# Altium project Rocos-FOC.PrjPcb
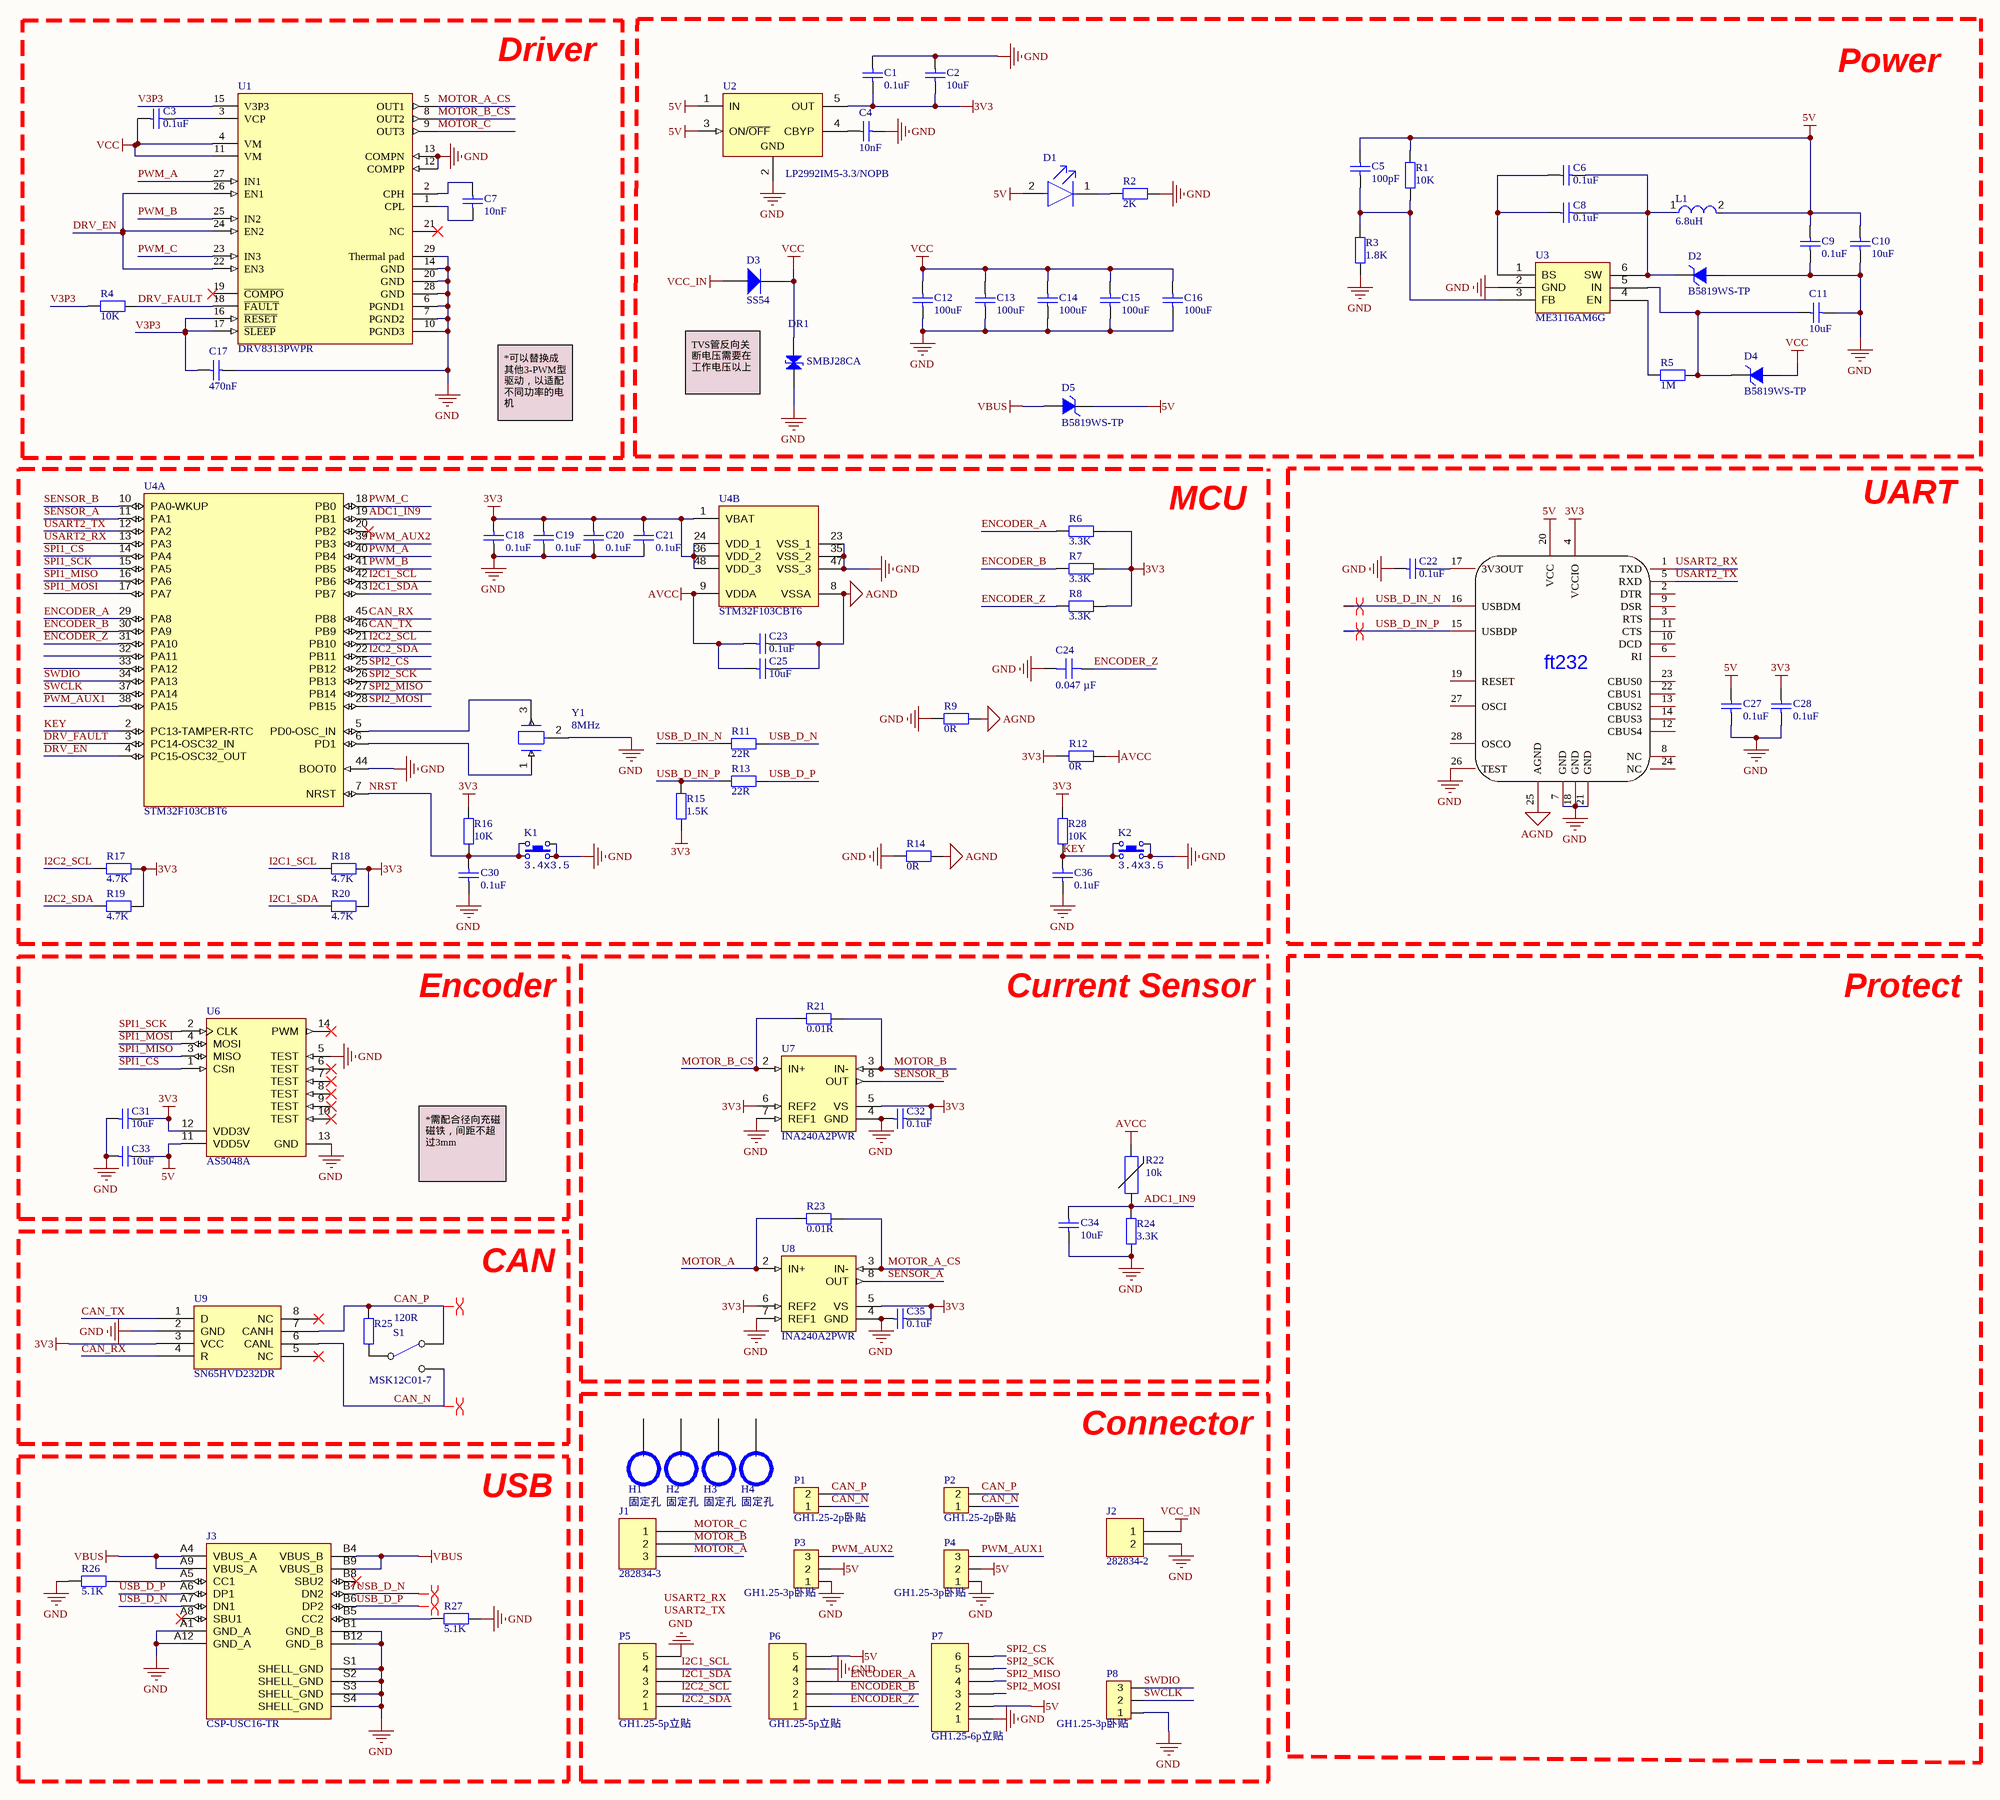
[diagram p0: Driver.SchDoc]
1 sheet, 96 parts. Net scope: global (net labels, ports and power ports of the same name join across sheets).
Board file: Driver.PcbDoc

## Sheet Driver.SchDoc
size 558 x 431 mm; SheetNumber: 1; SheetTotal: 1

### Parts
C1  0.1uF  [C 0402_L]
C2  10uF  [C 0402_L]
C3  0.1uF  [C 0402_L]
C4  10nF  [C 0402_L]
C5  100pF  [C 0402_L]
C6  0.1uF  [C 0402_L]
C7  10nF  [C 0402_L]
C8  0.1uF  [C 0402_L]
C9  0.1uF  [C 0402_L]
C10  10uF  [C 0402_L]
C11  10uF  [C 0402_L]
C12  100uF  [CAPC3216X190X55LL30T25]
C13  100uF  [CAPC3216X190X55LL30T25]
C14  100uF  [CAPC3216X190X55LL30T25]
C15  100uF  [CAPC3216X190X55LL30T25]
C16  100uF  [CAPC3216X190X55LL30T25]
C17  470nF  [C 0402_L]
C18  0.1uF  [C 0402_L]
C19  0.1uF  [C 0402_L]
C20  0.1uF  [C 0402_L]
C21  0.1uF  [C 0402_L]
C22  0.1uF  [C 0402_L]
C23  0.1uF  [C 0402_L]
C24  0.047 µF  [CAP 0402_1005]
C25  10uF  [C 0402_L]
C27  0.1uF  [C 0402_L]
C28  0.1uF  [C 0402_L]
C30  0.1uF  [C 0402_L]
C31  10uF  [C 0402_L]
C32  0.1uF  [C 0402_L]
C33  10uF  [C 0402_L]
C34  10uF  [C 0402_L]
C35  0.1uF  [C 0402_L]
C36  0.1uF  [C 0402_L]
D1  (no value)  [FP-APHHS1005CGCK-MFG]
D2  B5819WS-TP  [SOD-523]
D3  SS54  [SMA(DO-214AC)_S1]
D4  B5819WS-TP  [SOD-523]
D5  B5819WS-TP  [SOD-523]
DR1  SMBJ28CA  [SMB]
H1  固定孔  [铜柱孔3]
H2  固定孔  [铜柱孔3]
H3  固定孔  [铜柱孔3]
H4  固定孔  [铜柱孔3]
J1  282834-3  [TE 282834-3]
J2  282834-2  [TE 282834-2]
J3  CSP-USC16-TR  [VALCON_CSP-USC16-TR]
K1  value 3.4x3.5  [ButtonTACT_3.5*3.55_90]  (hidden comment: TACT 4P)
K2  value 3.4x3.5  [ButtonTACT_3.5*3.55_90]  (hidden comment: TACT 4P)
L1  6.8uH  [FP-LQH2MCN_52-MFG]
P1  GH1.25-2p卧贴  [GH1.25-2P]
P2  GH1.25-2p卧贴  [GH1.25-2P]
P3  GH1.25-3p卧贴  [GH1.25-3P]
P4  GH1.25-3p卧贴  [GH1.25-3P]
P5  GH1.25-5p立贴  [GH1.25-5p]
P6  GH1.25-5p立贴  [GH1.25-5p]
P7  GH1.25-6p立贴  [GH1.25-6p]
P8  GH1.25-3p卧贴  [GH1.25-3P]
R1  10K  [R 0402_L]
R2  2K  [R 0402_L]
R3  1.8K  [R 0402_L]
R4  10K  [R 0402_L]
R5  1M  [R 0402_L]
R6  3.3K  [R 0402_L]
R7  3.3K  [R 0402_L]
R8  3.3K  [R 0402_L]
R9  0R  [R 0402_L]
R11  22R  [R 0402_L]
R12  0R  [R 0402_L]
R13  22R  [R 0402_L]
R14  0R  [R 0402_L]
R15  1.5K  [R 0402_L]
R16  10K  [R 0402_L]
R17  4.7K  [R 0402_L]
R18  4.7K  [R 0402_L]
R19  4.7K  [R 0402_L]
R20  4.7K  [R 0402_L]
R21  0.01R  [R 0402_L]
R22  value 10k  [RES_0402]  (hidden comment: NCP15XH103F03RC)
R23  0.01R  [R 0402_L]
R24  3.3K  [R 0402_L]
R25  120R  [R 0402_L]
R26  5.1K  [R 0402_L]
R27  5.1K  [R 0402_L]
R28  10K  [R 0402_L]
S1  MSK12C01-7  [MSK-12C01-07]
U1  DRV8313PWPR  [FP-PWP0028C-IPC_B]
U2  LP2992IM5-3.3/NOPB  [DBV0005A_L]
U3  ME3116AM6G  [SOT-23-6]
U4  STM32F103CBT6  [LQFP-48_7x7x05P]  (parts A,B of 2)
U5  FT232RL-REEL  [SSOP28]  (value not drawn)
U6  AS5048A  [TSSOP-14]
U7  INA240A2PWR  [SOP65 P640X120-8N]
U8  INA240A2PWR  [SOP65 P640X120-8N]
U9  Manufacturer Part Number: SN65HVD232DR  [SO-8]  (hidden comment: SN65HVD232D)
Y1  8MHz  [FP-CSTNE8M00GH5C000R0-MFG]

### Blocks framed on the sheet
Driver: C3 C7 C17 R4 U1
Power: C1 C2 C4-C6 C8-C16 D1-D5 DR1 L1 R1-R3 R5 U2 U3
MCU: C18-C21 C23-C25 C30 C36 K1 K2 R6-R9 R11-R20 R28 U4 Y1
UART: C22 C27 C28 U5
Encoder: C31 C33 U6
Current Sensor: C32 C34 C35 R21-R24 U7 U8
CAN: R25 S1 U9
Connector: H1-H4 J1 J2 P1-P8
USB: J3 R26 R27

### Nets
3V3: C1.1 C2.1 C18.1 C19.1 C20.1 C21.1 C28.1 C31.1 C32.1 C35.1 R6.2 R7.2 R8.2 R12.1 R15.1 R16.2 R17.2 R18.2 R19.2 R20.2 R28.2 U2.5(OUT) U4.1(VBAT) U4.24(VDD_1) U4.36(VDD_2) U4.48(VDD_3) U5.4(VCCIO) U6.12(VDD3V) U7.5(VS) U7.6(REF2) U8.5(VS) U8.6(REF2) U9.3(VCC)
5V: C5.2 C9.1 C10.2 C27.1 C33.1 D1.2(A) D5.2(K) L1.2 P3.2 P4.2 P6.5 P7.2 R1.2 U2.1(IN) U2.3(ON/~{OFF}) U5.20(VCC) U6.11(VDD5V)
AGND: C23.1 C25.1 R9.2 R14.2 U4.8(VSSA) U5.25(AGND)
AVCC: C23.2 C25.2 R12.2 R22.2 U4.9(VDDA)
GND: C1.2 C2.2 C4.1 C9.2 C10.1 C11.1 C12.1 C13.1 C14.1 C15.1 C16.1 C17.2 C18.2 C19.2 C20.2 C21.2 C22.2 C24.1 C27.2 C28.2 C30.2 C31.2 C32.2 C33.2 C34.2 C35.2 C36.2 D2.1(A) DR1.2(K) J2.2 J3.A1(GND_A) J3.A12(GND_A) J3.B1(GND_B) J3.B12(GND_B) J3.S1(SHELL_GND) J3.S2(SHELL_GND) J3.S3(SHELL_GND) J3.S4(SHELL_GND) K1.2 K1.4 K2.2 K2.4 P3.1 P4.1 P5.5 P6.4 P7.1 P8.1 R2.2 R3.1 R9.1 R14.1 R24.1 R26.2 R27.1 U1.6(PGND1) U1.7(PGND2) U1.10(PGND3) U1.12(COMPP) U1.13(COMPN) U1.14(GND) U1.20(GND) U1.28(GND) U1.29(Thermal_pad) U2.2(GND) U3.2(GND) U4.23(VSS_1) U4.35(VSS_2) U4.44(BOOT0) U4.47(VSS_3) U5.7(GND) U5.18(GND) U5.21(GND) U5.26(TEST) U6.5(TEST) U6.13(GND) U7.4(GND) U7.7(REF1) U8.4(GND) U8.7(REF1) U9.2(GND) Y1.2(GND)
VBUS: D5.1(A) J3.A4(VBUS_A) J3.A9(VBUS_A) J3.B4(VBUS_B) J3.B9(VBUS_B)
VCC: C3.2 C12.2 C13.2 C14.2 C15.2 C16.2 D3.2(K) D4.1(A) DR1.1(A) U1.4(VM) U1.11(VM)
VCC_IN: D3.1(A) J2.1
ADC1_IN9: C34.1 R22.1 R24.2 U4.19(PB1)
CAN_N: P1.1 P2.1 S1.3 U9.6(CANL)
CAN_P: P1.2 P2.2 R25.2 S1.1 U9.7(CANH)
CAN_RX: U4.45(PB8) U9.4(R)
CAN_TX: U4.46(PB9) U9.1(D)
DRV_EN: U1.22(EN3) U1.24(EN2) U1.26(EN1) U4.4(PC15-OSC32_OUT)
DRV_FAULT: R4.1 U1.18(~{FAULT}) U4.3(PC14-OSC32_IN)
ENCODER_A: P6.3 R6.1 U4.29(PA8)
ENCODER_B: P6.2 R7.1 U4.30(PA9)
ENCODER_Z: C24.2 P6.1 R8.1 U4.31(PA10)
I2C1_SCL: P5.4 R18.1 U4.42(PB6)
I2C1_SDA: P5.3 R20.1 U4.43(PB7)
I2C2_SCL: P5.2 R17.1 U4.21(PB10)
I2C2_SDA: P5.1 R19.1 U4.22(PB11)
KEY: C36.1 K2.1 K2.3 R28.1 U4.2(PC13-TAMPER-RTC)
MOTOR_A: J1.3 R23.2 U8.2(IN+)
MOTOR_A_CS: R23.1 U1.5(OUT1) U8.3(IN-)
MOTOR_B: J1.2 R21.1 U7.3(IN-)
MOTOR_B_CS: R21.2 U1.8(OUT2) U7.2(IN+)
MOTOR_C: J1.1 U1.9(OUT3)
NRST: C30.1 K1.1 K1.3 R16.1 U4.7(NRST)
PWM_A: U1.27(IN1) U4.40(PB4)
PWM_AUX1: P4.3 U4.38(PA15)
PWM_AUX2: P3.3 U4.39(PB3)
PWM_B: U1.25(IN2) U4.41(PB5)
PWM_C: U1.23(IN3) U4.18(PB0)
SENSOR_A: U4.11(PA1) U8.8(OUT)
SENSOR_B: U4.10(PA0-WKUP) U7.8(OUT)
SPI1_CS: U4.14(PA4) U6.1(CSn)
SPI1_MISO: U4.16(PA6) U6.3(MISO)
SPI1_MOSI: U4.17(PA7) U6.4(MOSI)
SPI1_SCK: U4.15(PA5) U6.2(CLK)
SPI2_CS: P7.6 U4.25(PB12)
SPI2_MISO: P7.4 U4.27(PB14)
SPI2_MOSI: P7.3 U4.28(PB15)
SPI2_SCK: P7.5 U4.26(PB13)
SWCLK: P8.2 U4.37(PA14)
SWDIO: P8.3 U4.34(PA13)
USART2_RX: U4.13(PA3) U5.1(TXD)
USART2_TX: U4.12(PA2) U5.5(RXD)
USB_D_IN_N: R11.1 U5.16(USBDM)
USB_D_IN_P: R13.1 R15.2 U5.15(USBDP)
USB_D_N: J3.A7(DN1) J3.B7(DN2) R11.2
USB_D_P: J3.A6(DP1) J3.B6(DP2) R13.2
V3P3: C17.1 R4.2 U1.15(V3P3) U1.16(~{RESET}) U1.17(~{SLEEP})
NetC3_1: C3.1 U1.3(VCP)
NetC4_2: C4.2 U2.4(CBYP)
NetC5_1: C5.1 R1.1 R3.2 U3.3(FB)
NetC6_1: C6.1 C8.1 D2.2(K) L1.1 U3.6(SW)
NetC6_2: C6.2 C8.2 U3.1(BS)
NetC7_1: C7.1 U1.1(CPL)
NetC7_2: C7.2 U1.2(CPH)
NetC11_2: C11.2 D4.2(K) R5.1 U3.5(IN)
NetC22_1: C22.1 U5.17(3V3OUT)
NetD1_1: D1.1(C) R2.1
NetJ3_A5: J3.A5(CC1) R26.1
NetJ3_B5: J3.B5(CC2) R27.2
NetR5_2: R5.2 U3.4(EN)
NetR25_1: R25.1 S1.2
NetU4_5: U4.5(PD0-OSC_IN) Y1.3(Output)
NetU4_6: U4.6(PD1) Y1.1(Input)

Not connected (* = marked no-connect by the designer): H1 11; H2 11; H3 11; H4 11; J3 A8(SBU1)* B8(SBU2)*; U1 19(~{COMPO})* 21(NC)*; U4 20(PB2)* 32(PA11) 33(PA12); U5 2(DTR) 3(RTS) 6(RI) 8(NC) 9(DSR) 10(DCD) 11(CTS) 12(CBUS4) 13(CBUS2) 14(CBUS3) 19(RESET) 22(CBUS1) 23(CBUS0) 24(NC) 27(OSCI) 28(OSCO); U6 6(TEST)* 7(TEST)* 8(TEST)* 9(TEST)* 10(TEST)* 14(PWM)*; U9 5(NC)* 8(NC)*

### Layout directives
differential pair: CAN_N, CAN_P, USB_D_IN_N, USB_D_IN_P, USB_D_N, USB_D_P

### Notes on the sheet
- TVS管反向关断电压需要在工作电压以上
- *可以替换成其他3-PWM型驱动，以适配不同功率的电机
- (near U5) ft232
- Protect
- *需配合径向充磁磁铁，间距不超过3mm
- Labels drawn without touching a wire or pin: USART2_RX, USART2_TX
- DWG. NO.
- REV.
- SHT.
- REVISION
- DESCRIPTION
- DATE
- APPROVED
- THIS DOCUMENT AND THE DATA DISCLOSED HEREIN OR HEREWITH IS THE PROPERTY OF ALTIUM LIMITED AND MAY BE FREELY DISTRIBUTED IN WHOLE. NO RIGHTS ARE RESERVED OR EXPRESS OR IMPLIED WARANTEE GIVEN.
- ENG:
- DSN:
- APPROVALS
- PROJECT
- DOCUMENT REVISION:
- DESIGN ITEM:
- CHK:
- BOM:
- REFERENCE DOCUMENTS
- PROJECT REVISION:
- TITLE
- FAB DWG:
- PCB DWG:
- ASSY DWG:
- SCALE:
- SIZE
- C
- CAGE CODE
- FILE NAME
- DWG NO.
- SHEET
- OF
- REV

### Library data of the parts
C1-C4 C6 C8-C11 C18-C23 C25 C27 C28 C30-C36 = 0402 100nF (104) 10% 16V: 贴片电容; ComponentLink1Description: 供应商链接; ComponentLink1URL: http://www.szlcsc.com/product/details_1877.html; Package: 0402; Supplier: LC; SuppliersPartNumber: C1525
C5 = 0402 100pF (101) 5% 50V: 贴片电容; ComponentLink1Description: 供应商链接; ComponentLink1URL: http://www.szlcsc.com/product/details_1898.html; Package: 0402; Supplier: LC; SuppliersPartNumber: C1546
C7 = 0402 10nF (103) 10% 50V: 贴片电容; ComponentLink1Description: 供应商链接; ComponentLink1URL: http://www.szlcsc.com/product/details_15869.html; Package: 0402; Supplier: LC; SuppliersPartNumber: C15195
C12-C16 = CMP-1662-00011-2: Chip Capacitor, 100 uF, +/- 20%, 6.3 V, -55 to 85 degC, 1206 (3216 Metric), RoHS, Tape and Reel; PartNumber: GRM31CR60J107ME39L; Case\/Package: 1206; Voltage Rating (DC): 6.3 V; Type (Capacitors): X5R; REACH SVHC: No SVHC; Height: 1.6 mm; Tolerance: 20%; Packaging: Tape and Reel; Mount: Surface Mount; PackageDescription: 2-Pin Surface Mount Device, Body 3.2 x 1.6 mm; ComponentLink1URL: http://www.murata.com/; Pins: 2; ComponentLink2Description: Datasheet; PackageReference: 1206; Width: 1.6 mm; Package Quantity: 2000; Capacitance: 100 uF; Min Operating Temperature: -55 degC; Case Code (Imperial): 1206; Max Operating Temperature: 85 degC; DatasheetVersion: 09/2016; Mounting Technology: Surface Mount; Voltage Rating: 6.3 V; ComponentLink1Description: Manufacturer URL; Radiation Hardening: No; Case Code (Metric): 3216; Length: 3.2 mm; ComponentLink2URL: http://psearch.en.murata.com/capacitor/product/GRM31CR60J107ME39%23.pdf; RoHSCompliant: true
C17 = 0402 470nF (474) 10% 10V: 贴片电容; ComponentLink1Description: 供应商链接; ComponentLink1URL: http://www.szlcsc.com/product/details_48344.html; Package: 0402; Supplier: LC; SuppliersPartNumber: C47339
C24 = C0402C473K3REC7867: CAP CER 0402 47NF 25V X7R 10%; manufacturer: KEMET; Part Number: C0402C473K3REC7867; Value: 0.047 µF; Applications: ESD Protection; Capacitance: 0.047 µF; componentlink1description: Datasheet; componentlink1url: https://api.kemet.com/component-edge/download/datasheet/C0402C473K3REC7867.pdf; componentlink2description: DigiKey Link; componentlink2url: https://www.digikey.com/en/products/detail/kemet/C0402C473K3REC7867/8643594; Device Package: 0402 (1005 Metric); lastupdated: 2022/8/26 11:23:32; Lifecycle Status: Active; Minimum Order: 1; Mounting Type: Surface Mount, MLCC; Operating Temperature: -55°C ~ 125°C; Package / Case: 0402 (1005 Metric); packaging: TapeAndReel; partid: 33555; Part Status: Active; price: 0.01; series: ESD SMD Comm X7R; Size / Dimension: 0.039" L x 0.020" W (1.00mm x 0.50mm); Supplier 1: DigiKey; Supplier Part Number 1: 399-C0402C473K3REC7867CT-ND; Temperature Coefficient: X7R; Thickness (Max): 0.022" (0.55mm); Tolerance: ±10%; Voltage - Rated: 25V
D1 = CMP-44529-000044-1: LED GREEN CLEAR CHIP SMD; Viewing Angle: 120°; Dominant Wavelength: 570nm; Test Current: 20mA; Luminous Intensity: 50mcd; Forward Voltage: 2.1V; Number of LEDs: 1; Lens Color: Clear; Packaging: Tape and Reel; Max Operating Temperature: 85°C; Illumination Color: Green; Length: 1mm; Mount: Surface Mount; Lens Style: Clear; Color: Green; Number of Pins: 2; Wavelength: 570nm; Case/Package: 0402; Width: 0.5mm; Package Quantity: 2000; Case Code (Metric): 1005; Height: 0.6mm; Lead Free: Lead Free; Case Code (Imperial): 0402; Forward Current: 20mA; Min Operating Temperature: -40°C
D2 D4 D5 = 1N4733: 5.1V/1W稳压管; 版权归属: 源创客; BOM名称: 5.1V/1W稳压管; 学习资源: www.ooocke.com
D3 = SMA(DO-214AC) SS54: 二极管; ComponentLink1Description: 供应商链接; ComponentLink1URL: http://www.szlcsc.com/product/details_23178.html; Package: SMA(DO-214AC); Supplier: LC; SuppliersPartNumber: C22452
DR1 = DR: 瞬态电压抑制二极管; 版权归属: 源创客; BOM名称: 瞬态电压抑制二极管; 学习资源: www.ooocke.com
J1 = 282834-3: TERM BLK 3P SIDE ENT 2.54MM PCB; Manufacturer: TE Connectivity AMP Connectors; Current: 10A; Mating Orientation: Horizontal with Board; Number of Levels: 1; Pitch: 0.100" (2.54mm); Positions Per Level: 3; Voltage: 150V; Wire Gauge: 16-30 AWG; Wire Termination: Screw - Rising Cage Clamp; Part Number: 282834-3; Color: Green; ComponentLink1Description: Datasheet; ComponentLink1URL: https://www.te.com/commerce/DocumentDelivery/DDEController?Action=srchrtrv&DocNm=282834&DocType=Customer+Drawing&DocLang=English; ComponentLink2Description: DigiKey Link; ComponentLink2URL: http://digikey.com/product-detail/en/te-connectivity-amp-connectors/282834-3/A98334-ND/1153264; LastUpdated: 2020/1/15 4:15:50; Lifecycle Status: Active; Minimum Order: 1; Mounting Type: Through Hole; Packaging: Bulk; Part Status: Active; Price: 2.01; Series: Buchanan; Supplier 1: DigiKey; Supplier Part Number 1: A98334-ND
J2 = 282834-2: TERM BLK 2P SIDE ENT 2.54MM PCB; Manufacturer: TE Connectivity AMP Connectors; Current: 10A; Mating Orientation: Horizontal with Board; Number of Levels: 1; Pitch: 0.100" (2.54mm); Positions Per Level: 2; Voltage: 150V; Wire Gauge: 16-30 AWG; Wire Termination: Screw - Rising Cage Clamp; Part Number: 282834-2; Color: Green; ComponentLink1Description: Datasheet; ComponentLink1URL: https://www.te.com/commerce/DocumentDelivery/DDEController?Action=srchrtrv&DocNm=282834&DocType=Customer+Drawing&DocLang=English; ComponentLink2Description: DigiKey Link; ComponentLink2URL: http://digikey.com/product-detail/en/te-connectivity-amp-connectors/282834-2/A98333-ND/1150135; LastUpdated: 2020/1/15 4:15:38; Lifecycle Status: Active; Minimum Order: 1; Mounting Type: Through Hole; Packaging: Bulk; Part Status: Active; Price: 0.88; Series: Buchanan; Supplier 1: DigiKey; Supplier Part Number 1: A98333-ND
J3 = CSP-USC16-TR: CSP-USC16-TR Valcon USB Type C Surface Mount PCB Socket; Package: None; Purchase-URL: https://pricing.snapeda.com/search/part/CSP-USC16-TR/?ref=eda; MP: CSP-USC16-TR; Check_prices: https://www.snapeda.com/parts/CSP-USC16-TR/Valcon/view-part/4783629/?ref=eda; MF: Valcon; Value: *; Availability: No availability data; Price: None; SnapEDA_Link: https://www.snapeda.com/parts/CSP-USC16-TR/Valcon/view-part/4783629/?ref=snap
K1 K2 = ButtonTACT: Button; type: TACT 4P
L1 = CMP-06042-015166-1: Wire Wound Ferrite Inductor for Power Lines 6.8μH ±20% 1.6Ω 285mA 0806; Shielding: Unshielded; Test Frequency: 1MHz; Self Resonant Frequency: 65MHz; DC Resistance (DCR): 1.6R; Military Standard: Not; Length: 2mm; Case Code (Metric): 2016; Current Rating: 285mA; Package Quantity: 3000; Weight: 0.000317oz; Case Code (Imperial): 0806; Max Operating Temperature: 85°C; Width: 0.063inch; DC Current: 285mA; Core Material: Ferrite; Resistor Type: Wirewound; Inductance: 6.8uH; Height - Seated (Max): 0.037inch; Max DC Current: 285mA; Depth: 1.8mm; Termination: SMD/SMT; Min Operating Temperature: -40°C; Case/Package: 0806; Mount: Surface Mount; Tolerance: 20%; Packaging: Tape and Reel; Height: 0.9mm; Radiation Hardening: No
P1 P2 = SH1.0-2P
P3 P4 P8 = HDR1x3_2.54: Header
P5 P6 = MHDR1X5: Header, 5-Pin; LatestRevisionDate: 17-Jul-2002; LatestRevisionNote: Re-released for DXP Platform.; Publisher: Altium Limited
P7 = MHDR1X6: Header, 6-Pin; LatestRevisionDate: 17-Jul-2002; LatestRevisionNote: Re-released for DXP Platform.; Publisher: Altium Limited
R1 R3 R4 R26 R27 = 0402 1.2KΩ (1201) 1%: 贴片电阻; ComponentLink1Description: 供应商链接; ComponentLink1URL: http://www.szlcsc.com/product/details_26605.html; Package: 0402; Supplier: LC; SuppliersPartNumber: C25862
R2 R5 = 0402 2KΩ (2001) 1%: 贴片电阻; ComponentLink1Description: 供应商链接; ComponentLink1URL: http://www.szlcsc.com/product/details_4516.html; Package: 0402; Supplier: LC; SuppliersPartNumber: C4109
R6-R8 R24 = 0402 3.3KΩ (3301) 1%: 贴片电阻; ComponentLink1Description: 供应商链接; ComponentLink1URL: http://www.szlcsc.com/product/details_26633.html; Package: 0402; Supplier: LC; SuppliersPartNumber: C25890
R9 R12 R14 = 0402 0Ω (0R0) 1%: 贴片电阻; ComponentLink1Description: 供应商链接; ComponentLink1URL: http://www.szlcsc.com/product/details_17853.html; Package: 0402; Supplier: LC; SuppliersPartNumber: C17168
R11 R13 R21 R23 = 0402 22Ω (22R0) 1%: 贴片电阻; ComponentLink1Description: 供应商链接; ComponentLink1URL: http://www.szlcsc.com/product/details_25835.html; Package: 0402; Supplier: LC; SuppliersPartNumber: C25092
R15 = 0402 1.5KΩ (1501) 1%: 贴片电阻; ComponentLink1Description: 供应商链接; ComponentLink1URL: http://www.szlcsc.com/product/details_26610.html; Package: 0402; Supplier: LC; SuppliersPartNumber: C25867
R16 R28 = 0402 10KΩ (1002) 1%: 贴片电阻; ComponentLink1Description: 供应商链接; ComponentLink1URL: http://www.szlcsc.com/product/details_26487.html; Package: 0402; Supplier: LC; SuppliersPartNumber: C25744
R17-R20 = 0402 4.7KΩ (4701) 1%: 贴片电阻; ComponentLink1Description: 供应商链接; ComponentLink1URL: http://www.szlcsc.com/product/details_26643.html; Package: 0402; Supplier: LC; SuppliersPartNumber: C25900
R22 = NCP15XH103F03RC: THERMISTOR 10K OHM NTC 0402 SMD
R25 = 0402 120Ω (1200) 1%: 贴片电阻; ComponentLink1Description: 供应商链接; ComponentLink1URL: http://www.szlcsc.com/product/details_25822.html; Package: 0402; Supplier: LC; SuppliersPartNumber: C25079
S1 = T8013三脚两档钮子开关
U1 = CMP-04915-000025-1: IC MOTOR DRIVER 8V-60V 28HTSSOP; Min Supply Voltage: 8V; Max Supply Voltage: 60V; Interface: Parallel; Output Current: 1.75A; Number of Outputs: 1; Logic Function: AND GATE; Package Quantity: 2000; Number of Pins: 28; Case/Package: HTSSOP; Min Operating Temperature: -40°C; Mount: Surface Mount; Series: -; Packaging: Tape and Reel; Max Operating Temperature: 125°C; Lead Free: Lead Free
U2 = CMP-0062-02175-3: Micropower 250 mA Low-Noise Ultra Low-Dropout Regulator, 5-pin SOT-23, Pb-Free; Manufacturer: Texas Instruments; CompType: LDO IC; PackageTopMarking: LFEB*XTT; PowerWise: N; PackageReference: DBV0005A; ComponentLink1Description: Datasheet URL; RoHS: Y; PackageDescription: Molded SOT-23, .115 x .063 x .040 in Body, 5 Lead, .0375 in Pitch; ComponentLink1URL: http://www.ti.com/general/docs/lit/getliterature.tsp?genericPartNumber=LP2992&fileType=pdf; PinCount: 5
U3 = ME3116AM6G: DC/DC降压型稳压器
U4 = STM32F103CBT6: ARM; ComponentLink1Description: 供应商链接; ComponentLink1URL: http://www.szlcsc.com/product/details_8796.html; Package: LQFP-48_7x7x05P; Supplier: LC; SuppliersPartNumber: C8304
U5 = FT232RL-REEL: Manufacturer: FTDI(飞特帝亚); Add into BOM: yes; Name: FT232RL-REEL; Symbol: FT232RL-REEL; Device: FT232RL-REEL; LCSC Part Name: FT232RL-REEL; Supplier Part: C8690; Manufacturer Part: FT232RL-REEL; Supplier Footprint: SSOP-28-208mil; JLCPCB Part Class: Extended Part; Datasheet: https://atta.szlcsc.com/upload/public/pdf/source/20130221/1457706592200.pdf; Supplier: LCSC; Convert to PCB: yes; Type: -; Protocol: -; Number of Drivers/Receivers: -; Data Rate: -; Supply Voltage: -
U6 = AS5048A: 14 位旋转式位置传感器
U7 U8 = INA240A2PWR: -4 to 80V, bidirectional, ultra-precise current sense amplifier with enhanced PWM rejection 8-TSSOP -40 to 125; MF: Texas Instruments; MP: INA240A2PWR; Value: *; Package: TSSOP-8 Texas Instruments; Price: None; Availability: Good; Purchase-URL: https://pricing.snapeda.com/search/part/INA240A2PWR/?ref=eda; SnapEDA_Link: https://www.snapeda.com/parts/INA240A2PWR/Texas%20Instruments/view-part/588604/?ref=snap
U9 = SN65HVD232D: Manufacturer: Texas Instruments; Protocol: CAN; Number of Drivers/Receivers: 1/1; Duplex: Half; Data Rate: 1Mbps; Voltage - Supply: 3 V ~ 3.6 V; Supplier 1: Digi-Key; Supplier Part Number 1: 296-26344-2-ND; RoHS: RoHS Compliant; Category: Integrated Circuits (ICs); Stock: 5000; Pricing 1: 2500=0.84375 (USD); Packaging: Tape & Reel (TR); Part Status: Active; Type: Transceiver; Operating Temperature: -40°C ~ 85°C; Mounting Type: Surface Mount; Package / Case: 8-SOIC (0.154", 3.90mm Width); Supplier Device Package: 8-SOIC; ComponentLink1URL: http://www.ti.com/lit/ds/symlink/sn65hvd230.pdf; ComponentLink1Description: http://www.ti.com/lit/ds/symlink/sn65hvd230.pdf; Supplier 2: Digi-Key; Supplier Part Number 2: 296-26344-1-ND; Pricing 2: 1=2.05, 10=1.842, 100=1.4809, 500=1.21668, 1000=1.00811 (USD)
Y1 = CMP-06057-000001-1: CERAMIC RES 8.0000MHZ 33PF SMD; Frequency Stability: 0.13%; Frequency Tolerance: 0.07%; Impedance: 40R; Mount: Surface Mount; Min Operating Temperature: -40°C; Max Operating Temperature: 125°C; Resistor Type: Ceramic; Capacitance: 33pF; Packaging: Tape and Reel; Frequency: 8MHz; Case/Package: SMD/SMT